# Altium project gelistirme_karti1.PrjPcb (part 2 of 2)

## Sheet IOandSensors.SchDoc: STM32F3DISCOVERY
size A3; Engineer: Hamit Karatas; SheetNumber: 2; SheetTotal: 2
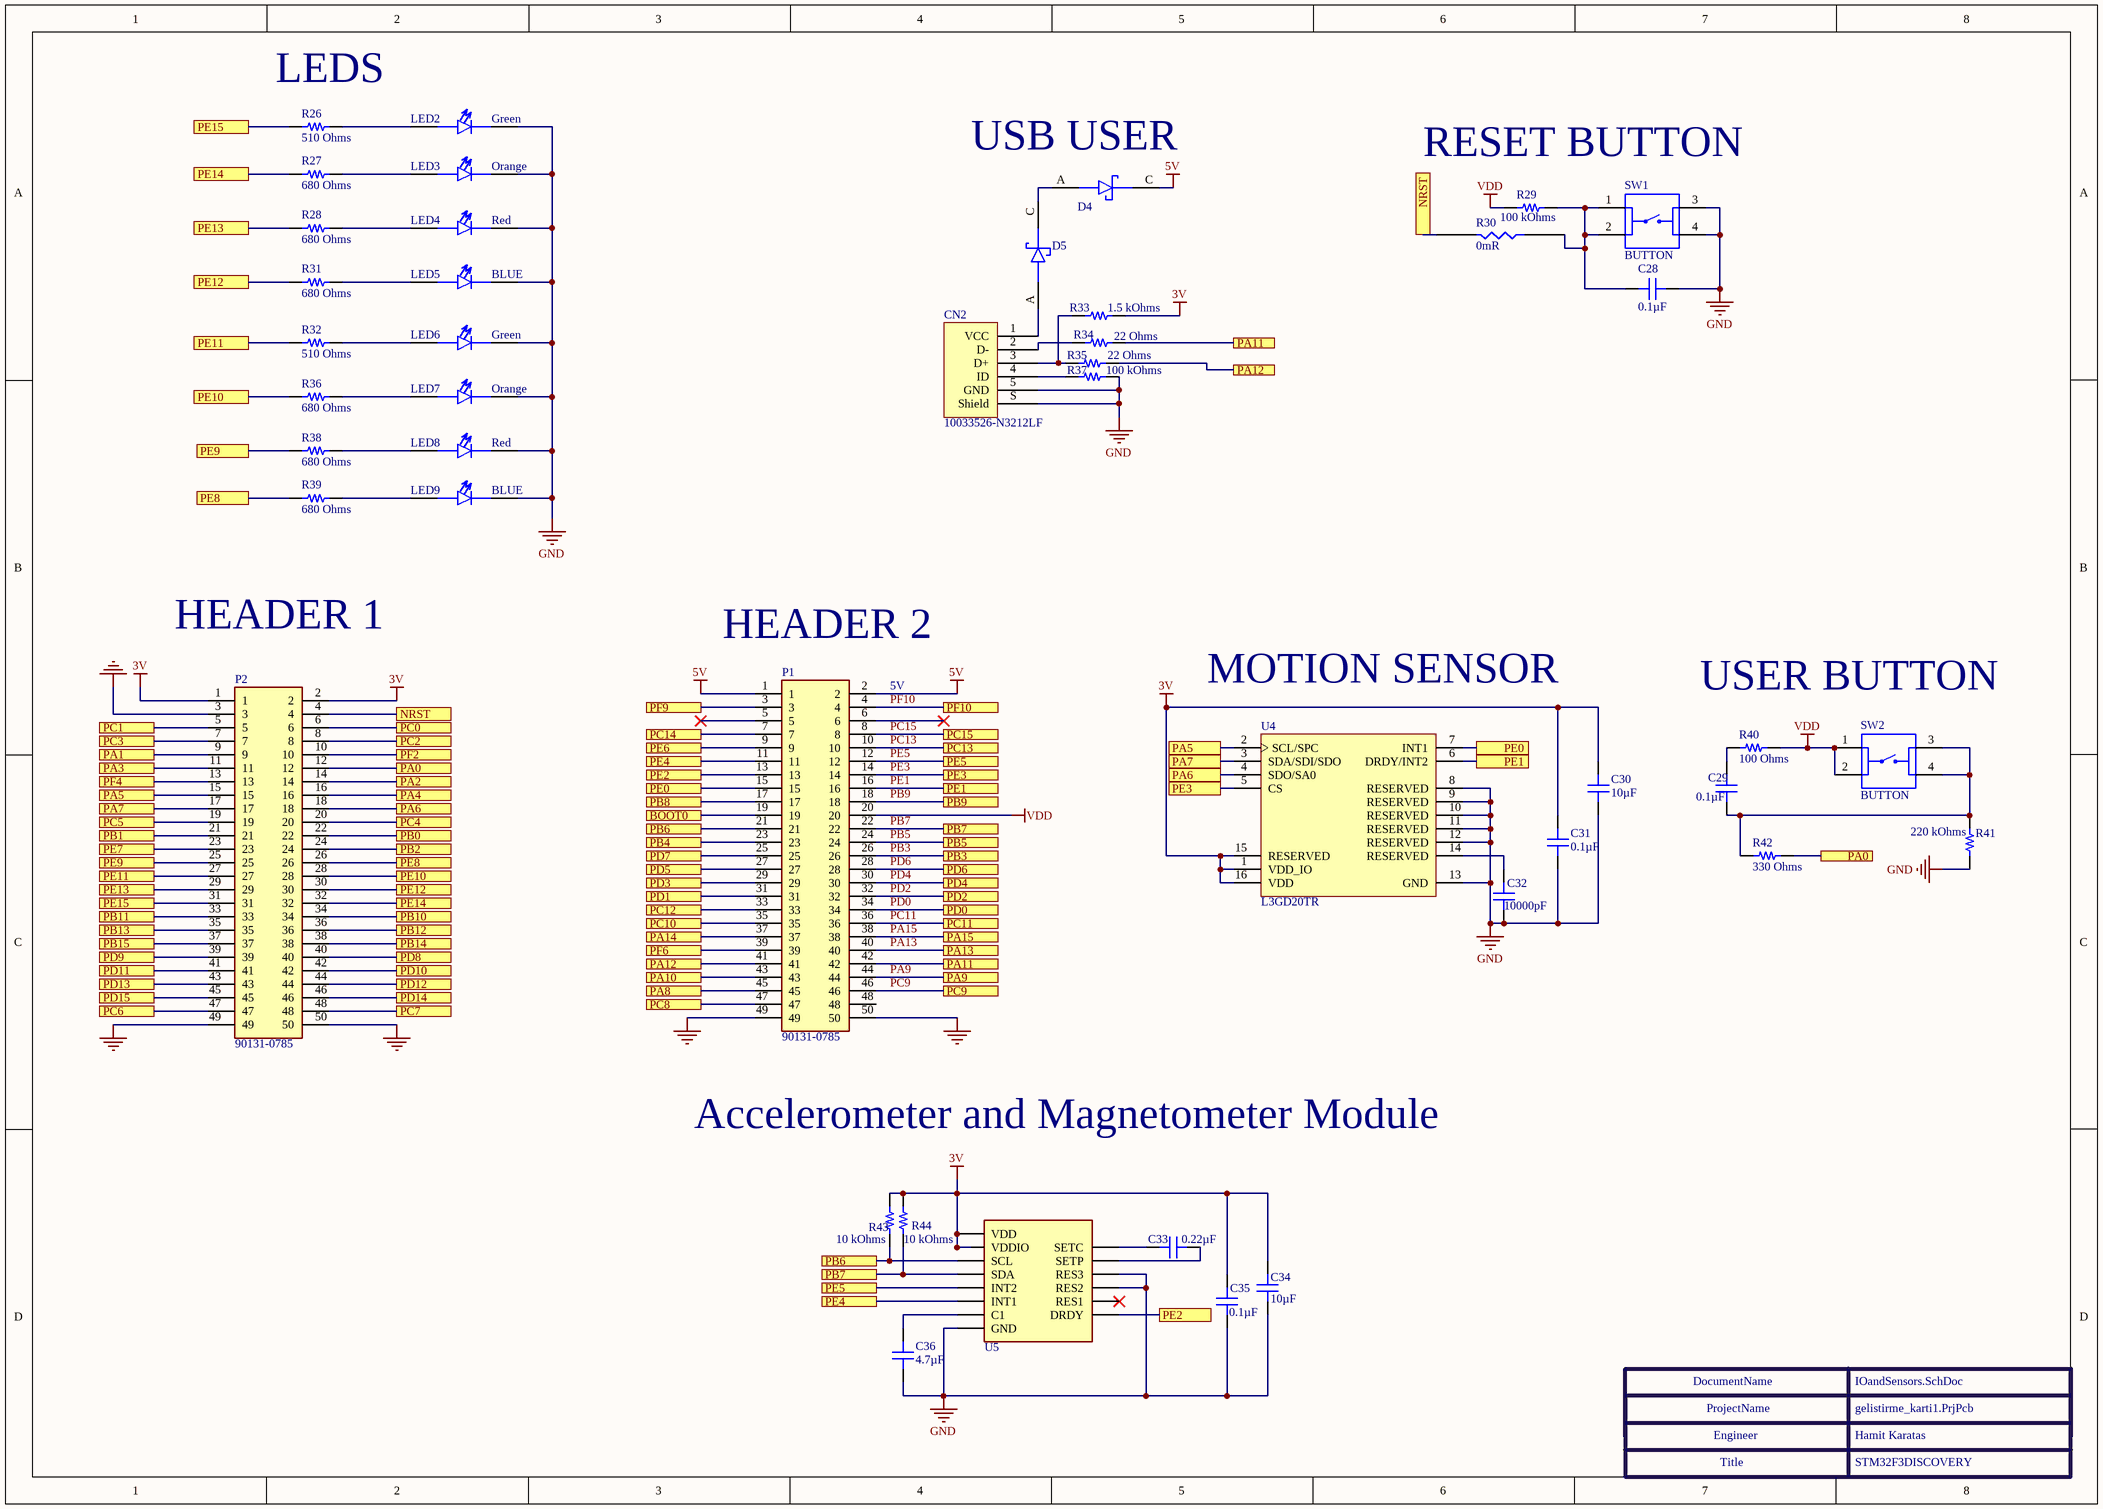
[diagram p1: IOandSensors.SchDoc]

### Parts
C28  0.1µF  [CAP 0603_1608]
C29  0.1µF  [CAP 0603_1608]
C30  10µF  [CAP 0603_1608]
C31  0.1µF  [CAP 0603_1608]
C32  10000pF  [CAP 0603_1608]
C33  0.22µF  [CAP 0603_1608]
C34  10µF  [CAP 0603_1608]
C35  0.1µF  [CAP 0603_1608]
C36  4.7µF  [CAP 0603_1608]
CN2  10033526-N3212LF  [FCI USB 10033526-N3212LF]
D4  BAT60J  [SOD-323]  (value not drawn)
D5  BAT60J  [SOD-323]  (value not drawn)
LED2  Green  [LED GREEN 0805]
LED3  Orange  [LED ORANGE 0805]
LED4  Red  [LED RED 0805]
LED5  BLUE  [LED BLUE 0805]
LED6  Green  [LED GREEN 0805]
LED7  Orange  [LED ORANGE 0805]
LED8  Red  [LED RED 0805]
LED9  BLUE  [LED BLUE 0805]
P1  90131-0785  [HDRV50W100P259X254_2X25_6350X516X595P]
P2  90131-0785  [HDRV50W100P259X254_2X25_6350X516X595P]
R26  510 Ohms  [RES 0603_1608]
R27  680 Ohms  [RES 0603_1608]
R28  680 Ohms  [RES 0603_1608]
R29  100 kOhms  [RES 0603_1608]
R30  Resistance: 0mR  [RES_0603]  (hidden comment: RC0603JR-070RL)
R31  680 Ohms  [RES 0603_1608]
R32  510 Ohms  [RES 0603_1608]
R33  1.5 kOhms  [RES 0603_1608]
R34  22 Ohms  [RES 0603_1608]
R35  22 Ohms  [RES 0603_1608]
R36  680 Ohms  [RES 0603_1608]
R37  100 kOhms  [RES 0603_1608]
R38  680 Ohms  [RES 0603_1608]
R39  680 Ohms  [RES 0603_1608]
R40  100 Ohms  [RES 0603_1608]
R41  220 kOhms  [RES 0603_1608]
R42  330 Ohms  [RES 0603_1608]
R43  10 kOhms  [RES 0603_1608]
R44  10 kOhms  [RES 0603_1608]
SW1  BUTTON  [BUTTON]
SW2  BUTTON  [BUTTON]
U4  L3GD20TR  [LGA-16]
U5  LSM303DLHCTR  [VFLGA-14]  (value not drawn)

### Ports
BOOT0, NRST, PA0, PA1, PA2, PA3, PA4, PA5, PA6, PA7, PA8, PA9, PA10, PA11, PA12, PA13, PA14, PA15, PB0, PB1, PB2, PB3, PB4, PB5, PB6, PB7, PB8, PB9, PB10, PB11, PB12, PB13, PB14, PB15, PC0, PC1, PC2, PC3, PC4, PC5, PC6, PC7, PC8, PC9, PC10, PC11, PC12, PC13, PC14, PC15, PD0, PD1, PD2, PD3, PD4, PD5, PD6, PD7, PD8, PD9, PD10, PD11, PD12, PD13, PD14, PD15, PE0, PE1, PE2, PE3, PE4, PE5, PE6, PE7, PE8, PE9, PE10, PE11, PE12, PE13, PE14, PE15, PF2, PF4, PF6, PF9, PF10

### Nets
3V: C30.2 C31.2 C34.2 C35.2 P2.1 P2.2 R33.2 R43.2 R44.2 U4.1(VDD_IO) U4.15(RESERVED) U4.16(VDD) U5.P$1(VDDIO) U5.P$14(VDD)
5V: D4.C P1.1 P1.2
GND: C28.1 C30.1 C31.1 C32.1 C34.1 C35.1 C36.1 CN2.5(GND) CN2.S(Shield) LED2.C LED3.C LED4.C LED5.C LED6.C LED7.C LED8.C LED9.C P1.49 P1.50 P2.3 P2.49 P2.50 R37.2 R41.1 SW1.3 SW1.4 U4.8(RESERVED) U4.9(RESERVED) U4.10(RESERVED) U4.11(RESERVED) U4.12(RESERVED) U4.13(GND) U5.P$7(GND) U5.P$10(RES2) U5.P$11(RES3)
VDD: P1.20 R29.2 R40.2 SW2.1 SW2.2
PA9: P1.44 ; port PA9
PA13: P1.40 ; port PA13
PA15: P1.38 ; port PA15
PB3: P1.26 ; port PB3
PB5: P1.24 ; port PB5
PB7: P1.22 R44.1 U5.P$3(SDA) ; port PB7
PB9: P1.18 ; port PB9
PC9: P1.46 ; port PC9
PC11: P1.36 ; port PC11
PC13: P1.10 ; port PC13
PC15: P1.8 ; port PC15
PD0: P1.34 ; port PD0
PD2: P1.32 ; port PD2
PD4: P1.30 ; port PD4
PD6: P1.28 ; port PD6
PE1: P1.16 U4.6(DRDY/INT2) ; port PE1
PE3: P1.14 U4.5(CS) ; port PE3
PE5: P1.12 U5.P$4(INT2) ; port PE5
PF10: P1.4 ; port PF10
NetC28_2: C28.2 R29.1 R30.1 SW1.1 SW1.2
NetC29_1: C29.1 R41.2 R42.2 SW2.3 SW2.4
NetC29_2: C29.2 R40.1
NetC32_2: C32.2 U4.14(RESERVED)
NetC33_1: C33.1 U5.P$13(SETC)
NetC33_2: C33.2 U5.P$12(SETP)
NetC36_2: C36.2 U5.P$6(C1)
NetCN2_1: CN2.1(VCC) D5.A
NetCN2_2: CN2.2(D-) R34.1
NetCN2_3: CN2.3(D+) R33.1 R35.1
NetCN2_4: CN2.4(ID) R37.1
NetD4_A: D4.A D5.C
NetLED2_A: LED2.A R26.2
NetLED3_A: LED3.A R27.2
NetLED4_A: LED4.A R28.2
NetLED5_A: LED5.A R31.2
NetLED6_A: LED6.A R32.2
NetLED7_A: LED7.A R36.2
NetLED8_A: LED8.A R38.2
NetLED9_A: LED9.A R39.2
NetP1_3: P1.3 ; port PF9
NetP1_7: P1.7 ; port PC14
NetP1_9: P1.9 ; port PE6
NetP1_11: P1.11 U5.P$5(INT1) ; port PE4
NetP1_13: P1.13 U5.P$9(DRDY) ; port PE2
NetP1_15: P1.15 U4.7(INT1) ; port PE0
NetP1_17: P1.17 ; port PB8
NetP1_19: P1.19 ; port BOOT0
NetP1_21: P1.21 R43.1 U5.P$2(SCL) ; port PB6
NetP1_23: P1.23 ; port PB4
NetP1_25: P1.25 ; port PD7
NetP1_27: P1.27 ; port PD5
NetP1_29: P1.29 ; port PD3
NetP1_31: P1.31 ; port PD1
NetP1_33: P1.33 ; port PC12
NetP1_35: P1.35 ; port PC10
NetP1_37: P1.37 ; port PA14
NetP1_39: P1.39 ; port PF6
NetP1_41: P1.41 R35.2 ; port PA12
NetP1_42: P1.42 R34.2 ; port PA11
NetP1_43: P1.43 ; port PA10
NetP1_45: P1.45 ; port PA8
NetP1_47: P1.47 ; port PC8
NetP2_4: P2.4 R30.2 ; port NRST
NetP2_5: P2.5 ; port PC1
NetP2_6: P2.6 ; port PC0
NetP2_7: P2.7 ; port PC3
NetP2_8: P2.8 ; port PC2
NetP2_9: P2.9 ; port PA1
NetP2_10: P2.10 ; port PF2
NetP2_11: P2.11 ; port PA3
NetP2_12: P2.12 R42.1 ; port PA0
NetP2_13: P2.13 ; port PF4
NetP2_14: P2.14 ; port PA2
NetP2_15: P2.15 U4.2(SCL/SPC) ; port PA5
NetP2_16: P2.16 ; port PA4
NetP2_17: P2.17 U4.3(SDA/SDI/SDO) ; port PA7
NetP2_18: P2.18 U4.4(SDO/SA0) ; port PA6
NetP2_19: P2.19 ; port PC5
NetP2_20: P2.20 ; port PC4
NetP2_21: P2.21 ; port PB1
NetP2_22: P2.22 ; port PB0
NetP2_23: P2.23 ; port PE7
NetP2_24: P2.24 ; port PB2
NetP2_25: P2.25 R38.1 ; port PE9
NetP2_26: P2.26 R39.1 ; port PE8
NetP2_27: P2.27 R32.1 ; port PE11
NetP2_28: P2.28 R36.1 ; port PE10
NetP2_29: P2.29 R28.1 ; port PE13
NetP2_30: P2.30 R31.1 ; port PE12
NetP2_31: P2.31 R26.1 ; port PE15
NetP2_32: P2.32 R27.1 ; port PE14
NetP2_33: P2.33 ; port PB11
NetP2_34: P2.34 ; port PB10
NetP2_35: P2.35 ; port PB13
NetP2_36: P2.36 ; port PB12
NetP2_37: P2.37 ; port PB15
NetP2_38: P2.38 ; port PB14
NetP2_39: P2.39 ; port PD9
NetP2_40: P2.40 ; port PD8
NetP2_41: P2.41 ; port PD11
NetP2_42: P2.42 ; port PD10
NetP2_43: P2.43 ; port PD13
NetP2_44: P2.44 ; port PD12
NetP2_45: P2.45 ; port PD15
NetP2_46: P2.46 ; port PD14
NetP2_47: P2.47 ; port PC6
NetP2_48: P2.48 ; port PC7

Not connected (* = marked no-connect by the designer): P1 5* 6* 48; U5 P$8(RES1)*

### Notes on the sheet
- (near R26) LEDS
- (near D4) USB USER
- RESET BUTTON
- HEADER 1
- (near P1) HEADER 2
- (near P1) 5V
- MOTION SENSOR
- USER BUTTON
- Accelerometer and Magnetometer Module
- DocumentName
- ProjectName
- Engineer
- Title

### Library data of the parts
C28 C29 C31 C35 = C0603C104K5RAC7411: CAP CER 0.1UF 50V X7R 0603; Manufacturer: KEMET; Tolerance: ±10%; Part Number: C0603C104K5RAC7411; Value: 0.1µF; Applications: Bypass, Decoupling; Capacitance: 0.1µF; ComponentLink1Description: Datasheet; ComponentLink1URL: https://api.kemet.com/component-edge/download/datasheet/C0603C104K5RAC7411.pdf; ComponentLink2Description: DigiKey Link; ComponentLink2URL: http://digikey.com/product-detail/en/kemet/C0603C104K5RAC7411/399-7374-2-ND/3317013; Device Package: 0603 (1608 Metric); LastUpdated: 2.09.2020 01:03:36; Lifecycle Status: Active; Minimum Order: 15000; Mounting Type: Surface Mount, MLCC; Operating Temperature: -55°C ~ 125°C; Package / Case: 0603 (1608 Metric); Packaging: TapeAndReel; PartId: 2233; Part Status: Active; Price: 0.02; Series: SMD Comm X7R; Size / Dimension: 0.063" L x 0.031" W (1.60mm x 0.80mm); Supplier 1: DigiKey; Supplier Part Number 1: 399-7374-2-ND; Temperature Coefficient: X7R; Thickness (Max): 0.035" (0.90mm); Voltage - Rated: 50V
C30 C34 = GRM188R60J106ME47D: CAP CER 10UF 6.3V X5R 0603; Manufacturer: Murata Electronics; Tolerance: ±20%; Part Number: GRM188R60J106ME47D; Value: 10µF; Applications: General Purpose; Capacitance: 10µF; ComponentLink1Description: Datasheet; ComponentLink1URL: https://www.murata.com/~/media/webrenewal/support/library/catalog/products/capacitor/mlcc/c02e.ashx?la=en-us; ComponentLink2Description: DigiKey Link; ComponentLink2URL: http://digikey.com/product-detail/en/murata-electronics/GRM188R60J106ME47D/490-3896-1-ND/965938; Device Package: 0603 (1608 Metric); LastUpdated: 2.09.2020 01:03:35; Lifecycle Status: Active; Minimum Order: 1; Mounting Type: Surface Mount, MLCC; Operating Temperature: -55°C ~ 85°C; Package / Case: 0603 (1608 Metric); Packaging: TapeAndReel; PartId: 2351; Part Status: Active; Price: 0.03; Series: GRM; Size / Dimension: 0.063" L x 0.031" W (1.60mm x 0.80mm); Supplier 1: DigiKey; Supplier Part Number 1: 490-3896-1-ND; Temperature Coefficient: X5R; Thickness (Max): 0.035" (0.90mm); Voltage - Rated: 6.3V
C32 = C0603X103K1RAC3316: CAP CER 0603 10NF 100V X7R; Manufacturer: KEMET; Tolerance: ±10%; Part Number: C0603X103K1RAC3316; Value: 10000pF; Applications: Automotive, Boardflex Sensitive; Capacitance: 10000pF; ComponentLink1Description: Datasheet; ComponentLink1URL: https://api.kemet.com/component-edge/download/datasheet/C0603X103K1RAC3316.pdf; ComponentLink2Description: DigiKey Link; ComponentLink2URL: http://digikey.com/product-detail/en/kemet/C0603X103K1RAC3316/399-C0603X103K1RAC3316CT-ND/10315834; Device Package: 0603 (1608 Metric); Features: Soft Termination; LastUpdated: 2.09.2020 01:03:25; Lifecycle Status: Active; Minimum Order: 1; Mounting Type: Surface Mount, MLCC; Operating Temperature: -55°C ~ 125°C; Package / Case: 0603 (1608 Metric); Packaging: TapeAndReel; PartId: 8591; Part Status: Active; Price: 0.09; Ratings: AEC-Q200; Series: SMD Auto X7R VW80808; Size / Dimension: 0.063" L x 0.031" W (1.60mm x 0.80mm); Supplier 1: DigiKey; Supplier Part Number 1: 399-C0603X103K1RAC3316CT-ND; Temperature Coefficient: X7R; Thickness (Max): 0.037" (0.95mm); Voltage - Rated: 100V
C33 = C0603C224K4RECAUTO: CAP CER 0603 220NF 16V X7R 10%; Manufacturer: KEMET; Part Number: C0603C224K4RECAUTO; Value: 0.22µF; Applications: Automotive, ESD Protection; Capacitance: 0.22µF; ComponentLink1Description: Datasheet; ComponentLink1URL: https://api.kemet.com/component-edge/download/datasheet/C0603C224K4RECAUTO.pdf; ComponentLink2Description: DigiKey Link; ComponentLink2URL: http://digikey.com/product-detail/en/kemet/C0603C224K4RECAUTO/399-17882-1-ND/8640549; Device Package: 0603 (1608 Metric); LastUpdated: 2.09.2020 01:03:11; Lifecycle Status: Active; Minimum Order: 1; Mounting Type: Surface Mount, MLCC; Operating Temperature: -55°C ~ 125°C; Package / Case: 0603 (1608 Metric); Packaging: TapeAndReel; PartId: 15101; Part Status: Active; Price: 0.03; Ratings: AEC-Q200; Series: ESD SMD Auto X7R; Size / Dimension: 0.063" L x 0.031" W (1.60mm x 0.80mm); Supplier 1: DigiKey; Supplier Part Number 1: 399-17882-1-ND; Temperature Coefficient: X7R; Thickness (Max): 0.034" (0.87mm); Tolerance: ±10%; Voltage - Rated: 16V
C36 = C0603C475K9PACTU: CAP CER 4.7UF 6.3V X5R 0603; Manufacturer: KEMET; Tolerance: ±10%; Part Number: C0603C475K9PACTU; Value: 4.7µF; Applications: General Purpose; Capacitance: 4.7µF; ComponentLink1Description: Datasheet; ComponentLink1URL: https://api.kemet.com/component-edge/download/datasheet/C0603C475K9PACTU.pdf; ComponentLink2Description: DigiKey Link; ComponentLink2URL: http://digikey.com/product-detail/en/kemet/C0603C475K9PACTU/399-3482-1-ND/754775; Device Package: 0603 (1608 Metric); LastUpdated: 2.09.2020 01:03:36; Lifecycle Status: Active; Minimum Order: 1; Mounting Type: Surface Mount, MLCC; Operating Temperature: -55°C ~ 85°C; Package / Case: 0603 (1608 Metric); Packaging: TapeAndReel; PartId: 2299; Part Status: Active; Price: 0.02; Series: SMD Comm X5R; Size / Dimension: 0.063" L x 0.031" W (1.60mm x 0.80mm); Supplier 1: DigiKey; Supplier Part Number 1: 399-3482-1-ND; Temperature Coefficient: X5R; Thickness (Max): 0.035" (0.90mm); Voltage - Rated: 6.3V
CN2 = 10033526-N3212LF: CONN RCPT MINI USB B 5POS SMD RA; Manufacturer: Amphenol ICC (FCI); Connector Type: USB - mini B; Current Rating (Amps): 1A per Contact; Gender: Receptacle; Mating Cycles: 5000; Number of Contacts: 5; Number of Ports: 1; Shielding: Shielded; Voltage - Rated: 30V; Part Number: 10033526-N3212LF; ComponentLink1Description: Datasheet; ComponentLink1URL: http://www.amphenol-icc.com/media/wysiwyg/files/drawing/10033526.pdf; ComponentLink2Description: DigiKey Link; ComponentLink2URL: //digikey.com/product-detail/en/amphenol-icc-fci/10033526-N3212LF/609-4700-2-ND/4292074; Features: Board Guide, Solder Retention; LastUpdated: 9.12.2019 20:52:14; Lifecycle Status: 0; Minimum Order: 1; Mounting Feature: Horizontal; Mounting Type: Surface Mount, Right Angle; Operating Temperature: -25°C ~ 85°C; Packaging: TapeAndReel; Part Status: Active; Price: 0.39; Series: -; Supplier 1: DigiKey; Supplier Part Number 1: 609-4700-2-ND; Termination: Solder
D4 D5 = DIODE SCHOTTKY: STMICROELECTRONICS - BAT60JFILM - Small Signal Schottky Diode, Single, 10 V, 3 A, 580 mV, 5 A, 150 °C; Forward Current: 3A; Max Reverse Current: 7.5uA; Peak Non-Repetitive Surge Current: 5A; Max Repetitive Reverse Voltage (Vrrm): 10V; Forward Voltage: 580mV; Polarity: Standard; Supplier 1: RSComponents; Manufacturer: STMicroelectronics; Manufacturer Part Number: BAT60JFILM; RoHS: Yes; Category: Rectifier Diodes; Stock 1: 1; Pricing 1: 100=0,09000, 500=0,08700, 1000=0,08500, 2500=0,08300, 5000=0,08100 (USD); Mount: Surface Mount; Number of Pins: 2; Weight: 0.01lb; Contact Plating: Tin,Matte; Min Operating Temperature: -65°C; Max Operating Temperature: 150°C; Element Configuration: Single; Packaging: Tape and Reel; Package Quantity: 1; Average Rectified Current: 3A; Voltage Rating (DC): 10V; Output Current: 3A; Current Rating: 3A; Max Reverse Voltage (DC): 10V; Series: -; Max Surge Current: 5A; Max Reverse Leakage Current: 7.5uA; Max Forward Surge Current (Ifsm): 5A; Length: 1.8mm; Width: 1.45mm; Height: 1.07mm; Radiation Hardening: No; Lead Free: Lead Free; RoHS Compliant: Yes; REACH SVHC: No SVHC; ComponentLink1URL: https://datasheet.ciiva.com/23916/cd00001944-23916545.pdf?src-supplier=Newark; ComponentLink1Description: https://datasheet.ciiva.com/23916/cd00001944-23916545.pdf?src-supplier=Newark; ComponentLink2URL: https://datasheet.ciiva.com/4714/cd00001944-96586-4714681.pdf?src-supplier=Mouser; ComponentLink2Description: https://datasheet.ciiva.com/4714/cd00001944-96586-4714681.pdf?src-supplier=Mouser; ComponentLink3URL: https://datasheet.ciiva.com/17078/bat60jfilm-17078717.pdf?src-supplier=Allied+Electronics; ComponentLink3Description: https://datasheet.ciiva.com/17078/bat60jfilm-17078717.pdf?src-supplier=Allied+Electronics; ComponentLink4URL: https://datasheet.ciiva.com/1200/1689728-1200741.pdf?src-supplier=Farnell; ComponentLink4Description: https://datasheet.ciiva.com/1200/1689728-1200741.pdf?src-supplier=Farnell; ComponentLink5URL: https://datasheet.ciiva.com/15144/getdatasheetpartid-91415-15144683.pdf?src-supplier=Verical; ComponentLink5Description: https://datasheet.ciiva.com/15144/getdatasheetpartid-91415-15144683.pdf?src-supplier=Verical; ComponentLink6URL: https://datasheet.ciiva.com/915/cd00001944-915607.pdf?src-supplier=Digi-Key; ComponentLink6Description: https://datasheet.ciiva.com/915/cd00001944-915607.pdf?src-supplier=Digi-Key; ComponentLink7URL: https://datasheet.ciiva.com/915/cd00001944-915608.pdf?src-supplier=Digi-Key; ComponentLink7Description: https://datasheet.ciiva.com/915/cd00001944-915608.pdf?src-supplier=Digi-Key; ComponentLink8URL: https://datasheet.ciiva.com/915/cd00001944-915609.pdf?src-supplier=Digi-Key; ComponentLink8Description: https://datasheet.ciiva.com/915/cd00001944-915609.pdf?src-supplier=Digi-Key; Supplier Part Number 1: 7146879
LED2 LED6 = LED GREEN 0805: Green 0805 130 º Min 5 mcd Typical 12 mcd Water Clear Lens SMT LED LTST-C171GKT; Manufacturer: Vishay Lite-On; Designed by: Hamit; Lens Color: Colorless; Viewing Angle: 130°; Lens Style: Diffused,Colorless,Rectangular,Clear; Luminous Intensity: 12mcd; Forward Current: 30mA; Forward Voltage: 2.1V; Power Rating: 100mW; Dominant Wavelength: 569nm; Test Current: 10mA; Number of Elements: 1; Wavelength: 585nm; Reverse Voltage: 5V; Supplier 1: Digi-Key; Manufacturer Part Number: LTST-C171GKT; RoHS: Yes; Category: LEDs; Pricing 1: 6000=0,00000 (USD); Mount: Surface Mount; Case/Package: 0805; Number of Pins: 2; Color: Green; Case Code (Metric): 2012; Case Code (Imperial): 0805; Min Operating Temperature: -55°C; Max Operating Temperature: 85°C; Package Quantity: 1; Packaging: Tape and Reel; Illumination Color: Green; Lens Transparency: Clear; Power Dissipation: 100mW; Number of LEDs: 1; Series: CHIPLED 0805; Length: 2mm; Width: 1.25mm; Height: 0.8mm; Depth: 1.25mm; Radiation Hardening: No; Lead Free: Lead Free; RoHS Compliant: Yes; ComponentLink1URL: https://datasheet.ciiva.com/2110/ltst-c171gkt-2110000.pdf?src-supplier=Digi-Key; ComponentLink1Description: https://datasheet.ciiva.com/2110/ltst-c171gkt-2110000.pdf?src-supplier=Digi-Key; ComponentLink2URL: https://datasheet.ciiva.com/11773/0900766b80dc0296-11773991.pdf?src-supplier=RSComponents; ComponentLink2Description: https://datasheet.ciiva.com/11773/0900766b80dc0296-11773991.pdf?src-supplier=RSComponents; ComponentLink3URL: https://datasheet.ciiva.com/12400/lite-on-ltst-c171gkt-190133-12400647.pdf?src-supplier=Mouser; ComponentLink3Description: https://datasheet.ciiva.com/12400/lite-on-ltst-c171gkt-190133-12400647.pdf?src-supplier=Mouser; ComponentLink4URL: https://datasheet.ciiva.com/2110/ltst-c171gkt-2110001.pdf?src-supplier=Digi-Key; ComponentLink4Description: https://datasheet.ciiva.com/2110/ltst-c171gkt-2110001.pdf?src-supplier=Digi-Key; ComponentLink5URL: https://datasheet.ciiva.com/2110/ltst-c171gkt-2110002.pdf?src-supplier=Digi-Key; ComponentLink5Description: https://datasheet.ciiva.com/2110/ltst-c171gkt-2110002.pdf?src-supplier=Digi-Key; ComponentLink6URL: https://datasheet.ciiva.com/16396/ltst-c171gkt-16396549.pdf?src-supplier=Future+Electronics; ComponentLink6Description: https://datasheet.ciiva.com/16396/ltst-c171gkt-16396549.pdf?src-supplier=Future+Electronics; Supplier Part Number 1: 160-1423-2-ND
LED3 LED7 = LED ORANGE 0805: LED Uni-Color Orange 610nm 2-Pin Chip 0805(2012Metric) T/R  LO R976-PS-1; Manufacturer: Osram Opto; Lens Color: White; Viewing Angle: 160°; Lens Style: Flat,Rectangular,Diffused,Colorless; Forward Current: 25mA; Forward Voltage: 2V; Luminous Intensity: 162.5mcd; Lens Transparency: Diffused; Test Current: 20mA; Dominant Wavelength: 606nm; Luminous Flux: 0.735lm; Number of LEDs: 1; Reverse Voltage: 12V; Lens Size: 1.25mm; Supplier 1: Mouser; Manufacturer Part Number: LOR976-PS-1; RoHS: Yes; Category: LEDs; Stock 1: 54051; Pricing 1: 1=0,26000, 10=0,18700, 50=0,18700, 100=0,07100, 1000=0,04600, 2500=0,03900, 8000=0,03600, 10000=0,03600, 24000=0,03200, 48000=0,02900, 100000=0,02700 (USD); Mount: Surface Mount; Case/Package: 0805; Number of Pins: 2; Color: Orange; Case Code (Metric): 2012; Case Code (Imperial): 0805; Contact Plating: Tin,Matte; Min Operating Temperature: -30°C; Max Operating Temperature: 85°C; Package Quantity: 16000; Packaging: Tape and Reel; Illumination Color: Orange; Series: CHIPLED 0805; Length: 2mm; Width: 1.25mm; Height: 0.9mm; Radiation Hardening: No; RoHS Compliant: Yes; ComponentLink1URL: https://datasheet.ciiva.com/2119/00078881-0-2119287.pdf?src-supplier=Digi-Key; ComponentLink1Description: https://datasheet.ciiva.com/2119/00078881-0-2119287.pdf?src-supplier=Digi-Key; ComponentLink2URL: https://datasheet.ciiva.com/2119/00078881-0-2119286.pdf?src-supplier=Digi-Key; ComponentLink2Description: https://datasheet.ciiva.com/2119/00078881-0-2119286.pdf?src-supplier=Digi-Key; ComponentLink3URL: https://datasheet.ciiva.com/2119/00078881-0-2119288.pdf?src-supplier=Digi-Key; ComponentLink3Description: https://datasheet.ciiva.com/2119/00078881-0-2119288.pdf?src-supplier=Digi-Key; Supplier Part Number 1: 720-LOR976-PS-1
LED4 LED8 = LED RED 0805: Single Color LED, Hyper Red, Colorless Diffused, 1.3mm LH R974-LP-1; Manufacturer: Osram Opto; Designed by: Hamit; Lens Color: White; Forward Voltage: 1.8V; Lens Style: Diffused,Flat,Colorless; Luminous Intensity: 71mcd; Viewing Angle: 160°; Forward Current: 30mA; Dominant Wavelength: 645nm; Number of Elements: 1; Test Current: 20mA; Reverse Voltage: 5V; Luminous Flux: 0.17lm; Lens Size: 1.25mm; Supplier 1: Digi-Key; Manufacturer Part Number: LH R974-LP-1; RoHS: Yes; Category: LEDs; Mount: Surface Mount; Case/Package: 0805; Number of Pins: 2; Color: Red; Case Code (Imperial): 0805; Case Code (Metric): 2012; Min Operating Temperature: -30°C; Max Operating Temperature: 85°C; Packaging: Tape and Reel; Illumination Color: Red; Package Quantity: 1; Series: CHipLED; Lens Transparency: Diffused; Length: 2.1mm; Width: 1.25mm; Depth: 1.35mm; Radiation Hardening: No; RoHS Compliant: Yes; ComponentLink1URL: http://www.jameco.com/Jameco/Products/ProdDS/2085634.pdf?src-supplier=Jameco; ComponentLink1Description: http://www.jameco.com/Jameco/Products/ProdDS/2085634.pdf?src-supplier=Jameco; ComponentLink2URL: http://components.arrow.com/part/dataview/0323_01825492?src-supplier=Arrow+Europe; ComponentLink2Description: http://components.arrow.com/part/dataview/0323_01825492?src-supplier=Arrow+Europe; ComponentLink3URL: https://dammedia.osram.info/media/resource/hires/osram-dam-2493888/LH%20R974.pdf?src-supplier=Digi-Key; ComponentLink3Description: https://dammedia.osram.info/media/resource/hires/osram-dam-2493888/LH%20R974.pdf?src-supplier=Digi-Key; ComponentLink4URL: http://www.mouser.com/ds/2/311/LH%20R974%20-%20CHIPLED%200805-318659.pdf?src-supplier=Mouser; ComponentLink4Description: http://www.mouser.com/ds/2/311/LH%20R974%20-%20CHIPLED%200805-318659.pdf?src-supplier=Mouser; ComponentLink5URL: https://www.verical.com/server-webapp/html/getDatasheet?partID=258950&src-supplier=Verical; ComponentLink5Description: https://www.verical.com/server-webapp/html/getDatasheet?partID=258950&src-supplier=Verical; ComponentLink6URL: http://components.arrow.com/part/dataview/41971690S1077610N9133?src-supplier=Arrow+Electronics; ComponentLink6Description: http://components.arrow.com/part/dataview/41971690S1077610N9133?src-supplier=Arrow+Electronics; ComponentLink7URL: http://components.arrow.com/part/dataview/41971690S6190115N2128?src-supplier=Arrow+Electronics; ComponentLink7Description: http://components.arrow.com/part/dataview/41971690S6190115N2128?src-supplier=Arrow+Electronics; Supplier Part Number 1: 475-1415-1-ND
LED5 LED9 = LED BLUE 0805: Standard LEDs - SMD BLUE 469nm 55mcd DIFF CMDA5CB7D1S; Manufacturer: VCC CHML; Power Rating: 98mW; Viewing Angle: 140°; Forward Voltage: 3.4V; Lens Style: Rectangular,Diffused,Colorless; Forward Current: 20mA; Reverse Voltage (DC): 5V; Lens Transparency: Diffused; Number of Elements: 1; Supplier 1: Digi-Key; Manufacturer Part Number: CMDA5CB7D1S; RoHS: No; Category: LEDs; Mount: Surface Mount; Case/Package: 0805; Number of Pins: 2; Color: Blue; Case Code (Metric): 2012; Case Code (Imperial): 0805; Min Operating Temperature: -30°C; Max Operating Temperature: 85°C; Luminous Intensity: 55mcd; Packaging: Tape and Reel; Package Quantity: 4000; Illumination Color: Blue; Wavelength: 469nm; Test Current: 20mA; Power Dissipation: 98mW; Reverse Voltage: 5V; Length: 2mm; Width: 1.25mm; Height: 0.8mm; Depth: 1.25mm; RoHS Compliant: No; ComponentLink1URL: https://datasheet.ciiva.com/2121/cmda5xx7d1s-2121694.pdf?src-supplier=Digi-Key; ComponentLink1Description: https://datasheet.ciiva.com/2121/cmda5xx7d1s-2121694.pdf?src-supplier=Digi-Key; Supplier Part Number 1: CMDA5CB7D1S-ND
P1 P2 = 90131-0785: Connector; Manufacturer_Name: Molex; Datasheet Link: http://uk.rs-online.com/web/p/products/6703525P; Height: 5.95mm; Manufacturer_Part_Number: 90131-0785; Mouser Part Number: 538-90131-0785; Mouser Price/Stock: https://www.mouser.co.uk/ProductDetail/Molex/90131-0785?qs=kEwmkoUtv7Tv91EFf1IFRQ%3D%3D
R26 R32 = ERJ-PB3D5100V: RES SMD 510 OHM 0.5% 1/5W 0603; Manufacturer: Panasonic Electronic Components; Power (Watts): 0.2W, 1/5W; Temperature Coefficient: ±50ppm/°C; Part Number: ERJ-PB3D5100V; Value: 510 Ohms; ComponentLink1Description: Datasheet; ComponentLink1URL: https://industrial.panasonic.com/cdbs/www-data/pdf/RDM0000/AOA0000C328.pdf; ComponentLink2Description: DigiKey Link; ComponentLink2URL: http://digikey.com/product-detail/en/panasonic-electronic-components/ERJ-PB3D5100V/P20249CT-ND/6214504; Composition: Thick Film; Device Package: 0603 (1608 Metric); Features: Automotive AEC-Q200, Pulse Withstanding; Height - Seated (Max): 0.022" (0.55mm); LastUpdated: 2.09.2020 01:10:12; Lifecycle Status: Active; Minimum Order: 1; Number of Terminations: 2; Operating Temperature: -55°C ~ 155°C; Package / Case: 0603 (1608 Metric); Packaging: TapeAndReel; PartId: 11326; Part Status: Active; Price: 0.02; Ratings: AEC-Q200; Resistance: 510 Ohms; Series: ERJ; Size / Dimension: 0.063" L x 0.031" W (1.60mm x 0.80mm); Supplier 1: DigiKey; Supplier Part Number 1: P20249CT-ND; Supplier Device Package: 0603; Tolerance: ±0.5%
R27 R28 R31 R36 R38 R39 = RK73H1JTTD6800F: RES 680 OHM 1% 1/8W 0603; Manufacturer: KOA Speer Electronics, Inc.; Power (Watts): 0.125W, 1/8W; Temperature Coefficient: ±100ppm/°C; Part Number: RK73H1JTTD6800F; Value: 680 Ohms; ComponentLink1Description: Datasheet; ComponentLink1URL: http://www.koaspeer.com/catimages/Products/RK73H/RK73H.pdf; ComponentLink2Description: DigiKey Link; ComponentLink2URL: http://digikey.com/product-detail/en/koa-speer-electronics-inc/RK73H1JTTD6800F/2019-RK73H1JTTD6800FCT-ND/9847014; Composition: Thick Film; Device Package: 0603 (1608 Metric); Features: Automotive AEC-Q200, Moisture Resistant; Height - Seated (Max): 0.022" (0.55mm); LastUpdated: 2.09.2020 01:10:22; Lifecycle Status: Active; Minimum Order: 1; Number of Terminations: 2; Operating Temperature: -55°C ~ 155°C; Package / Case: 0603 (1608 Metric); Packaging: CutTape; PartId: 6130; Part Status: Active; Price: 0.10; Ratings: AEC-Q200; Resistance: 680 Ohms; Series: RK73H; Size / Dimension: 0.063" L x 0.031" W (1.60mm x 0.80mm); Supplier 1: DigiKey; Supplier Part Number 1: 2019-RK73H1JTTD6800FCT-ND; Supplier Device Package: 0603; Tolerance: ±1%
R29 R37 = AT0603DRD07100KL: RES SMD 100K OHM 0.5% 1/10W 0603; Manufacturer: Yageo; Power (Watts): 0.1W, 1/10W; Temperature Coefficient: ±25ppm/°C; Part Number: AT0603DRD07100KL; Value: 100 kOhms; ComponentLink1Description: Datasheet; ComponentLink1URL: http://www.yageo.com/documents/recent/PYu-AT_51_RoHS_L_5.pdf; ComponentLink2Description: DigiKey Link; ComponentLink2URL: http://digikey.com/product-detail/en/yageo/AT0603DRD07100KL/311-2103-1-ND/6128522; Composition: Thin Film; Device Package: 0603 (1608 Metric); Features: Anti-Sulfur, Automotive AEC-Q200, Moisture Resistant; Height - Seated (Max): 0.022" (0.55mm); LastUpdated: 2.09.2020 01:10:25; Lifecycle Status: Active; Minimum Order: 1; Number of Terminations: 2; Operating Temperature: -55°C ~ 155°C; Package / Case: 0603 (1608 Metric); Packaging: TapeAndReel; PartId: 4903; Part Status: Active; Price: 0.02; Ratings: AEC-Q200; Resistance: 100 kOhms; Series: AT; Size / Dimension: 0.063" L x 0.031" W (1.60mm x 0.80mm); Supplier 1: DigiKey; Supplier Part Number 1: 311-2103-1-ND; Supplier Device Package: 0603; Tolerance: ±0.5%
R30 = Res 0 ohm 0603: RES SMD 0 OHM JUMPER 1/10W 0603; Manufacturer: Yageo; Designed by: Hamit; Tolerance: 1%; Power Rating: 100mW; Voltage Rating (DC): 50V; Temperature Coefficient: 200ppm/°C; Resistance Tolerance: 5%; Supplier 1: Digi-Key; Manufacturer Part Number: RC0603JR-070RL; RoHS: Yes; Category: Chip SMD Resistors; Stock 1: 6474034; Pricing 1: 1=0,10000, 10=0,01700, 25=0,01240, 50=0,00940, 100=0,00700, 250=0,00532, 500=0,00424, 1000=0,00313 (USD); Case/Package: 0603; Number of Pins: 2; Contact Plating: Tin,Matte; Case Code (Imperial): 0603; Case Code (Metric): 1608; Size Code: 0603; Min Operating Temperature: -55°C; Max Operating Temperature: 155°C; Resistor Type: Thick Film; Packaging: Tape and Reel; Termination: SMD/SMT; Series: RC; Technology: THICK FILM; Package Quantity: 5000; Voltage Rating: 50V; Features: Moisture Resistant; Max Power Dissipation: 100mW; Number of Terminations: 2; Construction: Rectangular; Length: 1.6mm; Width: 0.8mm; Height: 0.45mm; Depth: 0.8mm; Radiation Hardening: No; REACH SVHC: No SVHC; Lead Free: Lead Free; RoHS Compliant: Yes; Military Standard: Not; Supplier Part Number 1: 311-0.0GRDKR-ND
R33 = ERA-3AEB152V: RES SMD 1.5K OHM 0.1% 1/10W 0603; Manufacturer: Panasonic Electronic Components; Power (Watts): 0.1W, 1/10W; Temperature Coefficient: ±25ppm/°C; Part Number: ERA-3AEB152V; Value: 1.5 kOhms; ComponentLink1Description: Datasheet; ComponentLink1URL: https://industrial.panasonic.com/cdbs/www-data/pdf/RDM0000/AOA0000C307.pdf; ComponentLink2Description: DigiKey Link; ComponentLink2URL: http://digikey.com/product-detail/en/panasonic-electronic-components/ERA-3AEB152V/P1.5KDBCT-ND/1466056; Composition: Thin Film; Device Package: 0603 (1608 Metric); Features: Automotive AEC-Q200; Height - Seated (Max): 0.022" (0.55mm); LastUpdated: 2.09.2020 01:10:23; Lifecycle Status: Active; Minimum Order: 1; Number of Terminations: 2; Operating Temperature: -55°C ~ 155°C; Package / Case: 0603 (1608 Metric); Packaging: TapeAndReel; PartId: 5573; Part Status: Active; Price: 0.04; Ratings: AEC-Q200; Resistance: 1.5 kOhms; Series: ERA-3A; Size / Dimension: 0.063" L x 0.031" W (1.60mm x 0.80mm); Supplier 1: DigiKey; Supplier Part Number 1: P1.5KDBCT-ND; Supplier Device Package: 0603; Tolerance: ±0.1%
R34 R35 = RK73B1JTTD220J: RES 22 OHM 5% 1/8W 0603; Manufacturer: KOA Speer Electronics, Inc.; Power (Watts): 0.125W, 1/8W; Temperature Coefficient: ±200ppm/°C; Part Number: RK73B1JTTD220J; Value: 22 Ohms; ComponentLink1Description: Datasheet; ComponentLink1URL: http://www.koaspeer.com/catimages/Products/RK73B/RK73B.pdf; ComponentLink2Description: DigiKey Link; ComponentLink2URL: http://digikey.com/product-detail/en/koa-speer-electronics-inc/RK73B1JTTD220J/2019-RK73B1JTTD220JCT-ND/9846752; Composition: Thick Film; Device Package: 0603 (1608 Metric); Features: Automotive AEC-Q200, Moisture Resistant; Height - Seated (Max): 0.022" (0.55mm); LastUpdated: 2.09.2020 01:10:23; Lifecycle Status: Active; Minimum Order: 1; Number of Terminations: 2; Operating Temperature: -55°C ~ 155°C; Package / Case: 0603 (1608 Metric); Packaging: CutTape; PartId: 5932; Part Status: Active; Price: 0.10; Ratings: AEC-Q200; Resistance: 22 Ohms; Series: RK73B; Size / Dimension: 0.063" L x 0.031" W (1.60mm x 0.80mm); Supplier 1: DigiKey; Supplier Part Number 1: 2019-RK73B1JTTD220JCT-ND; Supplier Device Package: 0603; Tolerance: ±5%
R40 = RNCS0603BKE100R: RES 100 OHM 0.1% 1/16W 0603; Manufacturer: Stackpole Electronics Inc; Power (Watts): 0.063W, 1/16W; Temperature Coefficient: ±25ppm/°C; Part Number: RNCS0603BKE100R; Value: 100 Ohms; ComponentLink1Description: Datasheet; ComponentLink1URL: https://www.seielect.com/catalog/sei-rncs_rnch.pdf; ComponentLink2Description: DigiKey Link; ComponentLink2URL: http://digikey.com/product-detail/en/stackpole-electronics-inc/RNCS0603BKE100R/RNCS0603BKE100RCT-ND/1800117; Composition: Thin Film; Device Package: 0603 (1608 Metric); Features: Anti-Corrosive, Automotive AEC-Q200, Moisture Resistant; Height - Seated (Max): 0.022" (0.55mm); LastUpdated: 2.09.2020 01:10:25; Lifecycle Status: Active; Minimum Order: 1; Number of Terminations: 2; Operating Temperature: -55°C ~ 155°C; Package / Case: 0603 (1608 Metric); Packaging: TapeAndReel; PartId: 4839; Part Status: Active; Price: 0.08; Ratings: AEC-Q200; Resistance: 100 Ohms; Series: RNCS; Size / Dimension: 0.061" L x 0.031" W (1.55mm x 0.80mm); Supplier 1: DigiKey; Supplier Part Number 1: RNCS0603BKE100RCT-ND; Supplier Device Package: 0603; Tolerance: ±0.1%
R41 = AC0603JR-07220KL: RES SMD 220K OHM 5% 1/10W 0603; Manufacturer: Yageo; Power (Watts): 0.1W, 1/10W; Temperature Coefficient: ±100ppm/°C; Part Number: AC0603JR-07220KL; Value: 220 kOhms; ComponentLink1Description: Datasheet; ComponentLink1URL: https://www.yageo.com/upload/media/product/productsearch/datasheet/rchip/PYu-AC_51_RoHS_L_7.pdf; ComponentLink2Description: DigiKey Link; ComponentLink2URL: http://digikey.com/product-detail/en/yageo/AC0603JR-07220KL/YAG3651CT-ND/6006500; Composition: Thick Film; Device Package: 0603 (1608 Metric); Features: Automotive AEC-Q200, Moisture Resistant; Height - Seated (Max): 0.022" (0.55mm); LastUpdated: 2.09.2020 01:10:24; Lifecycle Status: Active; Minimum Order: 1; Number of Terminations: 2; Operating Temperature: -55°C ~ 155°C; Package / Case: 0603 (1608 Metric); Packaging: CutTape; PartId: 5120; Part Status: Active; Price: 0.10; Ratings: AEC-Q200; Resistance: 220 kOhms; Series: AC; Size / Dimension: 0.063" L x 0.031" W (1.60mm x 0.80mm); Supplier 1: DigiKey; Supplier Part Number 1: YAG3651CT-ND; Supplier Device Package: 0603; Tolerance: ±5%
R42 = AF0603FR-07330RL: RES SMD 330 OHM 1% 1/10W 0603; Manufacturer: Yageo; Power (Watts): 0.1W, 1/10W; Temperature Coefficient: ±100ppm/°C; Part Number: AF0603FR-07330RL; Value: 330 Ohms; ComponentLink1Description: Datasheet; ComponentLink1URL: http://www.yageo.com/documents/recent/PYu-AF_51_RoHS_L_6.pdf; ComponentLink2Description: DigiKey Link; ComponentLink2URL: http://digikey.com/product-detail/en/yageo/AF0603FR-07330RL/311-330LMCT-ND/2828182; Composition: Thick Film; Device Package: 0603 (1608 Metric); Features: Anti-Sulfur, Moisture Resistant; Height - Seated (Max): 0.022" (0.55mm); LastUpdated: 2.09.2020 01:10:18; Lifecycle Status: Active; Minimum Order: 1; Number of Terminations: 2; Operating Temperature: -55°C ~ 155°C; Package / Case: 0603 (1608 Metric); Packaging: TapeAndReel; PartId: 8150; Part Status: Active; Price: 0.01; Resistance: 330 Ohms; Series: AF; Size / Dimension: 0.063" L x 0.031" W (1.60mm x 0.80mm); Supplier 1: DigiKey; Supplier Part Number 1: 311-330LMCT-ND; Supplier Device Package: 0603; Tolerance: ±1%
R43 R44 = RT0603DRD0710KL: RES SMD 10K OHM 0.5% 1/10W 0603; Manufacturer: Yageo; Power (Watts): 0.1W, 1/10W; Temperature Coefficient: ±25ppm/°C; Part Number: RT0603DRD0710KL; Value: 10 kOhms; ComponentLink1Description: Datasheet; ComponentLink1URL: https://www.yageo.com/upload/media/product/productsearch/datasheet/rchip/PYu-RT_1-to-0.01_RoHS_L_11.pdf; ComponentLink2Description: DigiKey Link; ComponentLink2URL: http://digikey.com/product-detail/en/yageo/RT0603DRD0710KL/311-10KDCT-ND/1035680; Composition: Thin Film; Device Package: 0603 (1608 Metric); Height - Seated (Max): 0.022" (0.55mm); LastUpdated: 2.09.2020 01:10:23; Lifecycle Status: Active; Minimum Order: 1; Number of Terminations: 2; Operating Temperature: -55°C ~ 155°C; Package / Case: 0603 (1608 Metric); Packaging: TapeAndReel; PartId: 5487; Part Status: Active; Price: 0.02; Resistance: 10 kOhms; Series: RT; Size / Dimension: 0.063" L x 0.031" W (1.60mm x 0.80mm); Supplier 1: DigiKey; Supplier Part Number 1: 311-10KDCT-ND; Supplier Device Package: 0603; Tolerance: ±0.5%
SW1 SW2 = BUTTON: 6X6, H5,  160G TAC.SWITCH, 1825910-6; Manufacturer: TE Connectivity Alcoswitch; Mechanical Life: 100000Cycles; Actuator Material: PBT; Actuator Color: Black; Operating Force: 160gf; Illumination Type: Non-Illuminated,Illuminated; Throw Configuration: SPST; Switch Travel: 0.25mm; Switch Function: Off-Mom; Max Voltage Rating (DC): 24V; Contact Current Rating: 50mA; Actuator Type: Standard; Contact Resistance: 100mR; Actuator Length: 0.055inch; Supplier 1: Digi-Key; Manufacturer Part Number: 1825910-6; RoHS: Yes; Category: Pushbutton Switches; Stock 1: 153258; Pricing 1: 1=0,11000, 10=0,11100, 25=0,10520, 100=0,09550, 250=0,08980, 500=0,08216, 1000=0,06879, 2500=0,06688, 5000=0,06306 (USD); Mount: Through Hole; Contact Material: Copper Alloy; Contact Plating: Silver; Min Operating Temperature: -35°C; Max Operating Temperature: 85°C; Termination: PC Pins; Package Quantity: 750; Packaging: Loose Piece; Orientation: Straight; Series: FSMJ; Electrical Life: 100000Cycles; Type: Switch; Max Current Rating: 50mA; Length: 5.99mm; RoHS Compliant: Yes; REACH SVHC: Unknown; ELV: Compliant; Lead Free: Lead Free; ComponentLink1URL: https://datasheet.ciiva.com/30199/1825910-6rqpn1825910-6-30199520.pdf?src-supplier=Onlinecomponents.com; ComponentLink1Description: https://datasheet.ciiva.com/30199/1825910-6rqpn1825910-6-30199520.pdf?src-supplier=Onlinecomponents.com; ComponentLink2URL: https://datasheet.ciiva.com/15184/getdatasheetpartid-395915-15184509.pdf?src-supplier=Verical; ComponentLink2Description: https://datasheet.ciiva.com/15184/getdatasheetpartid-395915-15184509.pdf?src-supplier=Verical; Supplier Part Number 1: 450-1650-ND
U4 = Sensor_Gyroscope: MOTION MEMS CONSUMER; Manufacturer: STMicroelectronics; Max Supply Voltage: 3.6V; Min Supply Voltage: 2.4V; Nominal Supply Current: 6.1mA; Output Type: SPI,I2C,Digital,DIGITAL OUTPUT; Linearity: 0.2%; Interface: I2C,SPI; Supplier 1: Newark; Manufacturer Part Number: L3GD20TR; RoHS: Yes; Category: Gyroscopes; Pricing 1: 3000=2,41000 (USD); Case/Package: LGA; Number of Pins: 16; Min Operating Temperature: -40°C; Max Operating Temperature: 85°C; Package Quantity: 3000; Packaging: Tape and Reel; Operating Supply Voltage: 3.6V; Operating Supply Current: 6.1mA; Supply Current: 6.1mA; Series: L3GD20; Length: 4mm; Width: 4mm; Height: 1mm; Lead Free: Lead Free; RoHS Compliant: Yes; REACH SVHC: No SVHC; ComponentLink1URL: https://datasheet.ciiva.com/2815/dm00036465-2815728.pdf?src-supplier=Digi-Key; ComponentLink1Description: https://datasheet.ciiva.com/2815/dm00036465-2815728.pdf?src-supplier=Digi-Key; ComponentLink2URL: https://datasheet.ciiva.com/2815/dm00036465-2815729.pdf?src-supplier=Digi-Key; ComponentLink2Description: https://datasheet.ciiva.com/2815/dm00036465-2815729.pdf?src-supplier=Digi-Key; ComponentLink3URL: https://datasheet.ciiva.com/12092/dm00036465-12092269.pdf?src-supplier=Mouser; ComponentLink3Description: https://datasheet.ciiva.com/12092/dm00036465-12092269.pdf?src-supplier=Mouser; ComponentLink4URL: https://datasheet.ciiva.com/2815/dm00036465-2815727.pdf?src-supplier=Digi-Key; ComponentLink4Description: https://datasheet.ciiva.com/2815/dm00036465-2815727.pdf?src-supplier=Digi-Key; Supplier Part Number 1: 73T0645
U5 = Sensor_accelerometer_magnetometer: IMU ACCEL/MAG 3-AXIS I2C 14LGA; Manufacturer: STMicroelectronics; Operating Supply Voltage: 3.6V; Sensor Type: Accelerometer,Magnetometer,3 Axis; Output Type: I2C,Digital; Supplier 1: Digi-Key; Manufacturer Part Number: LSM303DLHCTR; RoHS: Yes; Category: Inertial Measurement Units (IMUs); Mount: Surface Mount; Case/Package: LGA; Number of Pins: 14; Min Operating Temperature: -40°C; Max Operating Temperature: 85°C; Packaging: Tape and Reel; Package Quantity: 1; Series: -; Radiation Hardening: No; Lead Free: Lead Free; RoHS Compliant: Yes; ComponentLink1URL: https://datasheet.ciiva.com/2816/dm00027543-2816209.pdf?src-supplier=Digi-Key; ComponentLink1Description: https://datasheet.ciiva.com/2816/dm00027543-2816209.pdf?src-supplier=Digi-Key; ComponentLink2URL: https://datasheet.ciiva.com/2816/dm00027543-2816210.pdf?src-supplier=Digi-Key; ComponentLink2Description: https://datasheet.ciiva.com/2816/dm00027543-2816210.pdf?src-supplier=Digi-Key; ComponentLink3URL: https://datasheet.ciiva.com/2816/dm00027543-2816211.pdf?src-supplier=Digi-Key; ComponentLink3Description: https://datasheet.ciiva.com/2816/dm00027543-2816211.pdf?src-supplier=Digi-Key; Supplier Part Number 1: 497-11918-6-ND

## Nets that join several sheets
3V: main (13 pins), IOandSensors (14 pins)
5V: main (5 pins), IOandSensors (D4.C P1.1 P1.2)
GND: main (49 pins), IOandSensors (35 pins)
VDD: main (15 pins), IOandSensors (5 pins)
NetP1_3: main (U3.10), IOandSensors (P1.3)
NetP1_7: main (R53.2), IOandSensors (P1.7)
NetP1_9: main (U3.5), IOandSensors (P1.9)
NetP1_11: main (U3.3), IOandSensors (P1.11 U5.P$5)
NetP1_13: main (U3.1), IOandSensors (P1.13 U5.P$9)
NetP1_15: main (U3.97), IOandSensors (P1.15 U4.7)
NetP1_17: main (U3.95), IOandSensors (P1.17)
NetP1_19: main (R25.1 U3.94), IOandSensors (P1.19)
NetP1_21: main (U3.92), IOandSensors (P1.21 R43.1 U5.P$2)
NetP1_23: main (U3.90), IOandSensors (P1.23)
NetP1_25: main (U3.88), IOandSensors (P1.25)
NetP1_27: main (U3.86), IOandSensors (P1.27)
NetP1_29: main (U3.84), IOandSensors (P1.29)
NetP1_31: main (U3.82), IOandSensors (P1.31)
NetP1_33: main (U3.80), IOandSensors (P1.33)
NetP1_35: main (U3.78), IOandSensors (P1.35)
NetP1_37: main (R46.2 U3.76), IOandSensors (P1.37)
NetP1_39: main (U3.73), IOandSensors (P1.39)
NetP1_41: main (U3.71), IOandSensors (P1.41 R35.2)
NetP1_42: main (U3.70), IOandSensors (P1.42 R34.2)
NetP1_43: main (U3.69), IOandSensors (P1.43)
NetP1_45: main (U3.67), IOandSensors (P1.45)
NetP1_47: main (U3.65), IOandSensors (P1.47)
NetP2_4: main (R21.2 U3.14), IOandSensors (P2.4 R30.2)
NetP2_5: main (U3.16), IOandSensors (P2.5)
NetP2_6: main (U3.15), IOandSensors (P2.6)
NetP2_7: main (U3.18), IOandSensors (P2.7)
NetP2_8: main (U3.17), IOandSensors (P2.8)
NetP2_9: main (U3.24), IOandSensors (P2.9)
NetP2_10: main (U3.19), IOandSensors (P2.10)
NetP2_11: main (U3.26), IOandSensors (P2.11)
NetP2_12: main (U3.23), IOandSensors (P2.12 R42.1)
NetP2_13: main (U3.27), IOandSensors (P2.13)
NetP2_14: main (U3.25), IOandSensors (P2.14)
NetP2_15: main (U3.30), IOandSensors (P2.15 U4.2)
NetP2_16: main (U3.29), IOandSensors (P2.16)
NetP2_17: main (U3.32), IOandSensors (P2.17 U4.3)
NetP2_18: main (U3.31), IOandSensors (P2.18 U4.4)
NetP2_19: main (U1.12 U3.34), IOandSensors (P2.19)
NetP2_20: main (U1.13 U3.33), IOandSensors (P2.20)
NetP2_21: main (U3.36), IOandSensors (P2.21)
NetP2_22: main (U3.35), IOandSensors (P2.22)
NetP2_23: main (U3.38), IOandSensors (P2.23)
NetP2_24: main (U3.37), IOandSensors (P2.24)
NetP2_25: main (U3.40), IOandSensors (P2.25 R38.1)
NetP2_26: main (U3.39), IOandSensors (P2.26 R39.1)
NetP2_27: main (U3.42), IOandSensors (P2.27 R32.1)
NetP2_28: main (U3.41), IOandSensors (P2.28 R36.1)
NetP2_29: main (U3.44), IOandSensors (P2.29 R28.1)
NetP2_30: main (U3.43), IOandSensors (P2.30 R31.1)
NetP2_31: main (U3.46), IOandSensors (P2.31 R26.1)
NetP2_32: main (U3.45), IOandSensors (P2.32 R27.1)
NetP2_33: main (U3.48), IOandSensors (P2.33)
NetP2_34: main (U3.47), IOandSensors (P2.34)
NetP2_35: main (U3.52), IOandSensors (P2.35)
NetP2_36: main (U3.51), IOandSensors (P2.36)
NetP2_37: main (U3.54), IOandSensors (P2.37)
NetP2_38: main (U3.53), IOandSensors (P2.38)
NetP2_39: main (U3.56), IOandSensors (P2.39)
NetP2_40: main (U3.55), IOandSensors (P2.40)
NetP2_41: main (U3.58), IOandSensors (P2.41)
NetP2_42: main (U3.57), IOandSensors (P2.42)
NetP2_43: main (U3.60), IOandSensors (P2.43)
NetP2_44: main (U3.59), IOandSensors (P2.44)
NetP2_45: main (U3.62), IOandSensors (P2.45)
NetP2_46: main (U3.61), IOandSensors (P2.46)
NetP2_47: main (U3.63), IOandSensors (P2.47)
NetP2_48: main (U3.64), IOandSensors (P2.48)
PA9: main (U3.68), IOandSensors (P1.44)
PA13: main (R45.2 U3.72), IOandSensors (P1.40)
PA15: main (U3.77), IOandSensors (P1.38)
PB3: main (R23.2 U3.89), IOandSensors (P1.26)
PB5: main (U3.91), IOandSensors (P1.24)
PB7: main (U3.93), IOandSensors (P1.22 R44.1 U5.P$3)
PB9: main (U3.96), IOandSensors (P1.18)
PC9: main (U3.66), IOandSensors (P1.46)
PC11: main (U3.79), IOandSensors (P1.36)
PC13: main (U3.7), IOandSensors (P1.10)
PC15: main (R52.2), IOandSensors (P1.8)
PD0: main (U3.81), IOandSensors (P1.34)
PD2: main (U3.83), IOandSensors (P1.32)
PD4: main (U3.85), IOandSensors (P1.30)
PD6: main (U3.87), IOandSensors (P1.28)
PE1: main (U3.98), IOandSensors (P1.16 U4.6)
PE3: main (U3.2), IOandSensors (P1.14 U4.5)
PE5: main (U3.4), IOandSensors (P1.12 U5.P$4)
PF10: main (U3.11), IOandSensors (P1.4)